# EAGLE design roller-shutter (EAGLE 9.6.2)
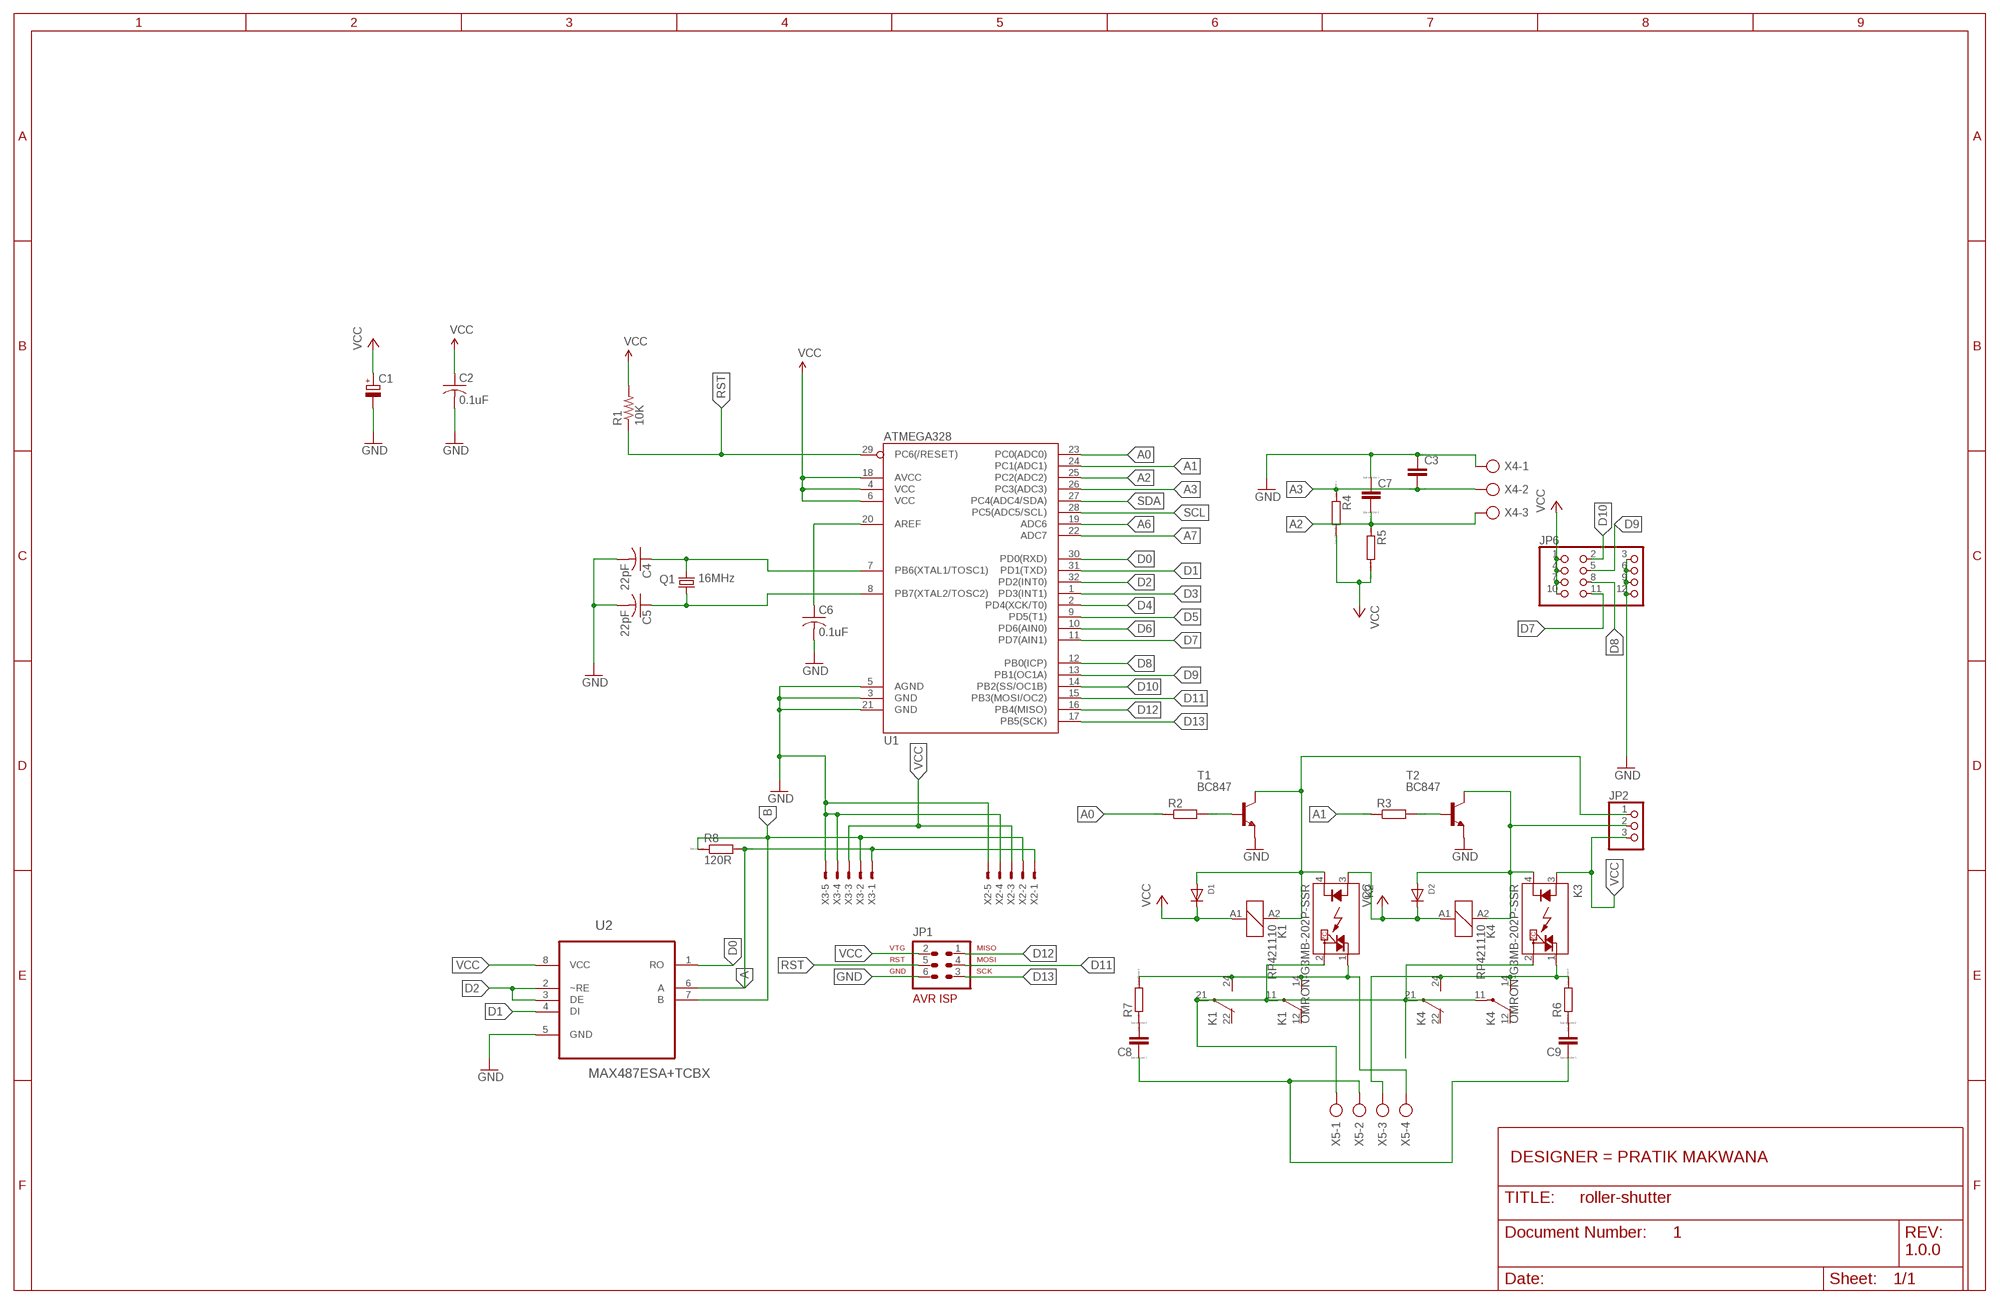
[diagram p0: schematic, sheet 1]
FRAME1 (FRAME_B_L): DESIGNER: PRATIK MAKWANA; DOC: 1; REV: 1.0.0

## Parts
C1  CPOL-EUSANYO_SMD_C6  [SANYO-OSCON_SMD_C6]
C2  0.1uF  C-USC0805  [C0805]
C3  C  [C0805]
C4  22pF  C-USC1206  [C1206]
C5  22pF  C-USC1206  [C1206]
C6  0.1uF  C-USC0805  [C0805]
C7  C  [C0805]
C8  CC1812  [C1812]
C9  CC1812  [C1812]
D1  DIODE_SOD-123FL  [SOD-123FL]
D2  DIODE_SOD-123FL  [SOD-123FL]
JP1  AVR-ISP-6  [AVR-ISP-6]
JP2  PINHD-1X3  [1X03]
JP6  PINHD-3X4  [3X04]
K1  RP421110  [RP420]
K2  OMRON-G3MB-202P-SSR  [OMRON-G3MB-202P-SSR]
K3  OMRON-G3MB-202P-SSR  [OMRON-G3MB-202P-SSR]
K4  RP421110  [RP420]
Q1  16MHz  CRYTALHC49S  [HC49/S]
R1  10K  R-US_R1206  [R1206]
R2  RR1206  [R1206]
R3  RR1206  [R1206]
R4  RR1206  [R1206]
R5  RR1206  [R1206]
R6  RR2512  [R2512]
R7  RR2512  [R2512]
R8  120R  RR0603  [R0603]
T1  BC847  [SOT23]
T2  BC847  [SOT23]
U1  ATMEGA328  [TQFP32-08]
U2  MAX487ESA+TCBX  [SOIC127P600X175-8N]
X2  JST-XH-05-PIN-LONG-PAD  [JST-XH-05-PACKAGE-LONG-PAD]
X3  JST-XH-05-PIN-LONG-PAD  [JST-XH-05-PACKAGE-LONG-PAD]
X4  AK500/3  [AK500/3]
X5  AK500/4  [AK500/4]

## Nets
A: R8.2 U2.6(A) X2.1 X3.1
A0: R2.1 U1.23(PC0(ADC0))
A1: R3.1 U1.24(PC1(ADC1))
A2: C7.2 R5.1 U1.25(PC2(ADC2)) X4.3
A3: C3.2 R4.1 U1.26(PC3(ADC3)) X4.2
A6: U1.19(ADC6)
A7: U1.22(ADC7)
AREF: C6.1 U1.20(AREF)
B: R8.1 U2.7(B) X2.2 X3.2
D0: U1.30(PD0(RXD)) U2.1(RO)
D1: U1.31(PD1(TXD)) U2.4(DI)
D2: U1.32(PD2(INT0)) U2.2(~RE) U2.3(DE)
D3: U1.1(PD3(INT1))
D4: U1.2(PD4(XCK/T0))
D5: U1.9(PD5(T1))
D6: U1.10(PD6(AIN0))
D7: JP6.11 U1.11(PD7(AIN1))
D8: JP6.8 U1.12(PB0(ICP))
D9: JP6.5 U1.13(PB1(OC1A))
D10: JP6.2 U1.14(PB2(SS/OC1B))
D11: JP1.4 U1.15(PB3(MOSI/OC2))
D12: JP1.1 U1.16(PB4(MISO))
D13: JP1.3 U1.17(PB5(SCK))
GND: C1.- C2.2 C3.1 C4.2 C5.2 C6.2 C7.1 JP1.6 JP6.3 JP6.6 JP6.9 JP6.12 T1.2(E) T2.2(E) U1.3(GND) U1.5(AGND) U1.21(GND) U2.5(GND) X2.4 X2.5 X3.4 X3.5 X4.1
N$1: D1.A JP2.1 K1.A2 K2.4(K) T1.3(C)
N$2: D2.A JP2.2 K3.4(K) K4.A2 T2.3(C)
N$4: K1.11(2:P) K1.21(3:P) K2.2(DS2) K3.2(DS2) K4.11(2:P) K4.21(3:P) X5.1
N$5: R2.2 T1.1(B)
N$6: R3.2 T2.1(B)
N$7: K1.14(2:S) K1.24(3:S) K2.1(DS1) R7.2 X5.4
N$8: K3.1(DS1) K4.14(2:S) K4.24(3:S) R6.2 X5.3
N$9: C8.2 R7.1
N$10: C9.2 R6.1
N$11: C8.1 C9.1 X5.2
N$43: C4.1 Q1.2 U1.7(PB6(XTAL1/TOSC1))
N$44: C5.1 Q1.1 U1.8(PB7(XTAL2/TOSC2))
RST: JP1.5 R1.1 U1.29(PC6(/RESET))
SCL: U1.28(PC5(ADC5/SCL))
SDA: U1.27(PC4(ADC4/SDA))
VCC: C1.+ C2.1 D1.C D2.C JP1.2 JP2.3 JP6.1 JP6.4 JP6.7 JP6.10 K1.A1 K2.3(A) K3.3(A) K4.A1 R1.2 R4.2 R5.2 U1.4(VCC) U1.6(VCC) U1.18(AVCC) U2.8(VCC) X2.3 X3.3
Unconnected: K1.12(2:O) K1.22(3:O) K4.12(2:O) K4.22(3:O)

## Library data of the parts
C1 = rcl:CPOL-EU: POLARIZED CAPACITOR, European symbol; SPICEPREFIX: C
C2 C4-C6 = adafruit:C-US: CAPACITOR, American symbol
C3 C7-C9 = eagle-ltspice:C: CAPACITOR, European symbol; SPICEMODEL: NONE; SPICEPREFIX: C
D1 D2 = adafruit:DIODE: Diode SMADIODE - SMA Surface Mount Package 20V 1A Schottky Diode Digikey: 641-1014-6-ND DO-1N4148 - Through Hole Small Current Diode SOD-123 20V 1 A (.5mV Vf) Schottky Diode - Digikey: MBRX120TPMSCT-ND SOD-323 10V 570mA (.38mV Vf, 3ns) Schottky Diode - Digikey: ZLLS410CT-ND SOD-523 30V 30mA Schottky Diode (RB751S-40TE61) - Digikey: RB751S-40TE61CT-ND SOT23-R/W - SOT23 Package (R = Solder Paste/Reflow Ovens, W = Hand-Soldering) BAT54Film 40V 300mA - Digikey: 497-7162-1-ND
JP1 = atmel-1:AVR-ISP-6: AVR ISP-6 Serial Programming Header
JP2 = pinhead:PINHD-1X3: PIN HEADER
JP6 = pinhead-zmiany-JP:PINHD-3X4: PIN HEADER
K1 K4 = relay:RP42?*: Power PCB Relay RP II/2 Schrack 2 pole 8 A Source: http://www.schrack.com/.. 5844.pdf; MF: TYCO ELECTRONICS; MPN: RP421110; OC_FARNELL: unknown; OC_NEWARK: 39C2625
K2 K3 = Omron G3MB 202p SSR:OMRON-G3MB-202P-SSR: IT(rms) 8A, Zero Cross type SIP 4pin Triac output SSR Source: http://sharp-world.com/products/device/lineup/data/pdf/datasheet/s102s02_e.pdf
Q1 = crystal:CRYTAL: CRYSTAL
R1 = adafruit:R-US_: RESISTOR, American symbol
R2-R8 = eagle-ltspice:R: RESISTOR, European symbol; SPICEMODEL: NONE; SPICEPREFIX: R
T1 T2 = transistor:BC847: NPN TRANSISTOR
U1 = thecustomgeek:ATMEGA328: ATmega328P-AU TQFP 32 pin
U2 = MAX487ESA_TCBX:MAX487ESA+TCBX: Low-Power, Slew-Rate-Limited RS-485/RS-422 Transceivers Check prices <https://pricing.snapeda.com/parts/MAX487ESA%2BTCBX/Maxim%20Integrated/view-part?ref=eda>; AVAILABILITY: Warning; DESCRIPTION: 1/1 Transceiver Half RS422, RS485 8-SOIC; MF: Maxim Integrated; MP: MAX487ESA+TCBX; PACKAGE: SOIC-8 Maxim Integrated; PRICE: None; PURCHASE-URL: https://pricing.snapeda.com/search/part/MAX487ESA+TCBX/?ref=eda
X2 X3 = Rembrandt Electronics - JST XH Connectors v1-0:JST-XH-05-PIN: JST XH Connector 2 Pin Wire to board connector. Pitch: 2,54 mm, (0.100") Number of pins: 5 Created by Rembrandt Electronics www.rembrandtelectronics.com
X4 = con-ptr500:AK500/3: CONNECTOR; OC_FARNELL: unknown; OC_NEWARK: unknown
X5 = con-ptr500:AK500/4: CONNECTOR; OC_FARNELL: unknown; OC_NEWARK: unknown

## Board
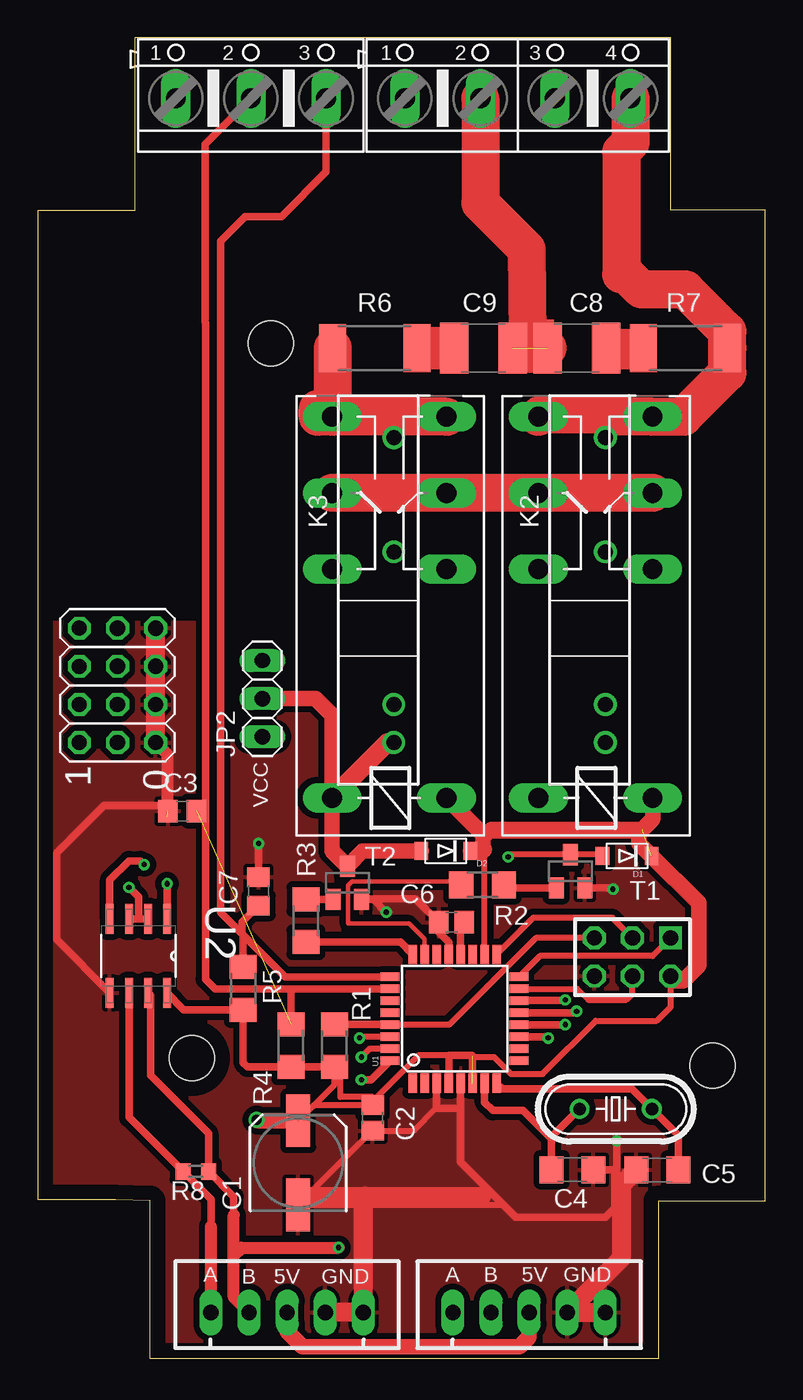
[diagram p1: board, top side]
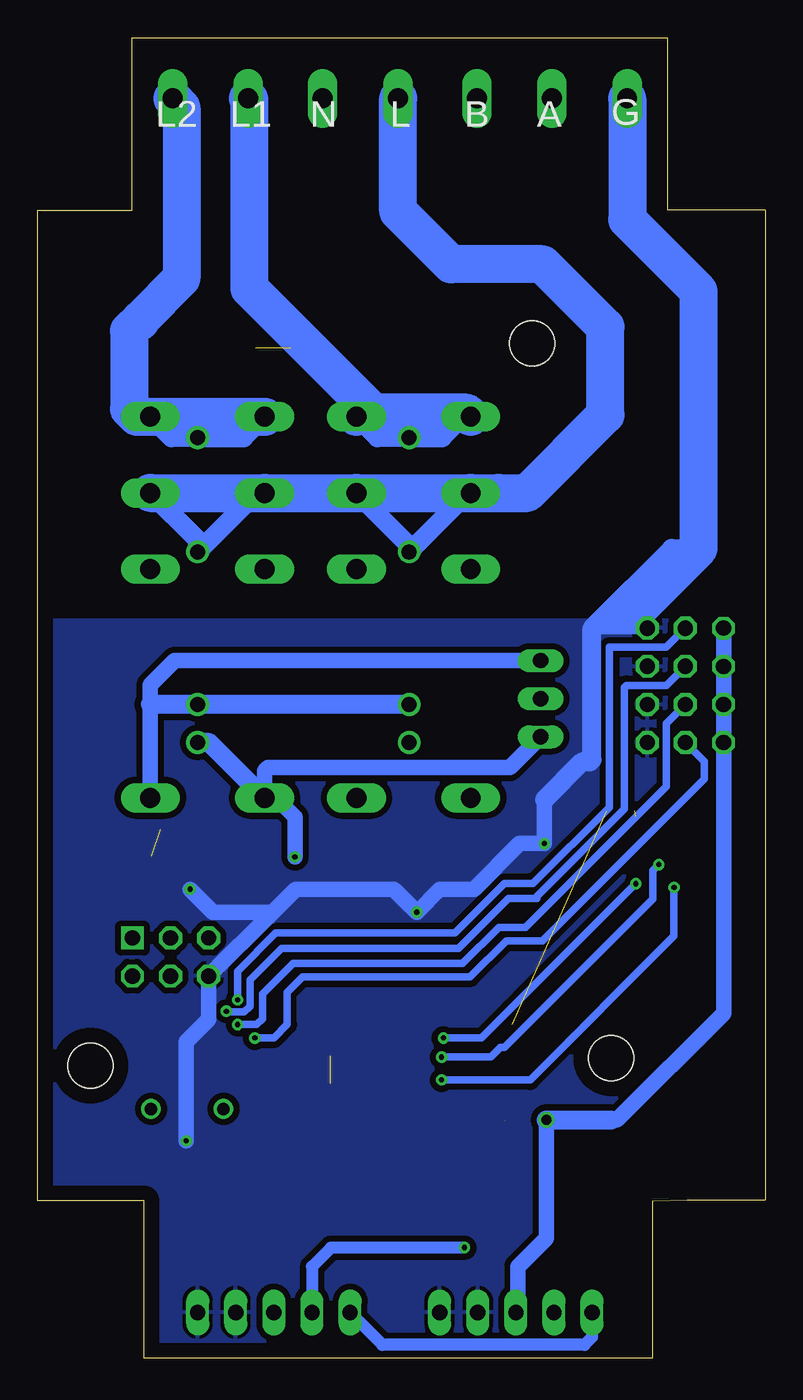
[diagram p2: board, bottom side, seen from below]

Size 48.5 x 88 mm. Coordinates in mm from the lower left corner, seen from the top.
Outline: 7.5,0 41.4,0 41.4,10.5 48.5,10.5 48.5,76.5 42.2,76.5 42.2,88 6.5,88 6.5,76.5 0,76.5 0,10.54 5.21,10.54 7.5,10.5 7.5,0
Copper layers (1*16): Top 0.035mm / dielectric 1.5mm / Bottom 0.035mm
Design rules "default": minimum track width 6mil, minimum drill 0.35mm, track to track 6mil, track to pad 6mil, pad to pad 6mil, via to via 6mil, smd to smd 6mil, copper to edge 40mil, drill to drill 6mil, minimum pad ring 10mil, minimum via ring 8mil, stop-mask expansion 4mil, vias tented up to drill 0mil, thermal gap 10mil
Holes 3 mm at 10.3,20 15.55,67.62 45,19.5

### Footprints (pad centres in the part's own frame; a part is rotated, then mirrored left to right if it is on the bottom)
SANYO-OSCON_SMD_C6 = smd 3.5 x 1.6: + 2.8,0; - -2.8,0
C0805 = smd 1.3 x 1.5: 1 -0.85,0; 2 0.85,0
C0805' = smd 1.3 x 1.5: 1 -0.95,0; 2 0.95,0
C1206 = smd 1.6 x 1.8: 1 -1.4,0; 2 1.4,0
C1812 = smd 1.9 x 3.4: 1 -1.95,0; 2 1.95,0
SOD-123FL = smd 0.91 x 1.22: A 1.637,0; C -1.637,0
AVR-ISP-6 = drill 1.016 square: 1 -2.54,-1.27 | drill 1.016 octagon: 2 -2.54,1.27; 3 0,-1.27; 4 0,1.27; 5 2.54,-1.27; 6 2.54,1.27
1X03 = drill 1.016 long: 1 -2.54,0; 2 0,0; 3 2.54,0
3X04 = drill 1 octagon: 1 -3.81,-3.81; 4 -1.27,-3.81; 7 1.27,-3.81; 10 3.81,-3.81 | drill 1.016 octagon: 2 -3.81,-1.27; 3 -3.81,1.27; 5 -1.27,-1.27; 6 -1.27,1.27; 8 1.27,-1.27; 9 1.27,1.27; 11 3.81,-1.27; 12 3.81,1.27
RP420 = drill 1.321 long: 11 16.51,-3.81; 12 11.43,-3.81; 14 21.59,-3.81; 21 16.51,3.81; 22 11.43,3.81; 24 21.59,3.81; A1 -3.81,-3.81; A2 -3.81,3.81
OMRON-G3MB-202P-SSR = drill 1: 1 -12.7,0; 2 -5.08,0; 3 5.08,0; 4 7.62,0
HC49/S = drill 0.813: 1 -2.413,0; 2 2.413,0
R1206 = smd 1.6 x 1.803: 1 -1.422,0; 2 1.422,0
R2512 = smd 1.8 x 3.2: 1 -2.8,0; 2 2.8,0
R0603 = smd 1 x 1.1: 1 -0.85,0; 2 0.85,0
SOT23 = smd 1 x 1.4: 1 -0.95,-1.1; 2 0.95,-1.1; 3 0,1.1
TQFP32-08 = smd 1.27 x 0.559: 1 -4.293,2.8; 2 -4.293,2; 3 -4.293,1.2; 4 -4.293,0.4; 5 -4.293,-0.4; 6 -4.293,-1.2; 7 -4.293,-2; 8 -4.293,-2.8; 17 4.293,-2.8; 18 4.293,-2; 19 4.293,-1.2; 20 4.293,-0.4; 21 4.293,0.4; 22 4.293,1.2; 23 4.293,2; 24 4.293,2.8 | smd 0.559 x 1.27: 9 -2.8,-4.293; 10 -2,-4.293; 11 -1.2,-4.293; 12 -0.4,-4.293; 13 0.4,-4.293; 14 1.2,-4.293; 15 2,-4.293; 16 2.8,-4.293; 25 2.8,4.293; 26 2,4.293; 27 1.2,4.293; 28 0.4,4.293; 29 -0.4,4.293; 30 -1.2,4.293; 31 -2,4.293; 32 -2.8,4.293
SOIC127P600X175-8N = smd 1.981 x 0.533: 1 -2.464,1.905; 2 -2.464,0.635; 3 -2.464,-0.635; 4 -2.464,-1.905; 5 2.464,-1.905; 6 2.464,-0.635; 7 2.464,0.635; 8 2.464,1.905
JST-XH-05-PACKAGE-LONG-PAD = drill 1.016 long: 1 -5.08,0; 2 -2.54,0; 3 0,0; 4 2.54,0; 5 5.08,0
AK500/3 = drill 1.321 long: 1 -5.004,0; 2 0,0; 3 5.004,0
AK500/4 = drill 1.321 long: 1 -7.518,0; 2 -2.489,0; 3 2.489,0; 4 7.518,0

### Placement (x,y rotation side)
C1  17.38,13.02 90 top
C2  22.34,16.01 270 top
C3  [C0805']  9.65,36.45 0 top
C4  35.66,12.56 0 top
C5  41.33,12.54 180 top
C6  27.6,29.05 180 top
C7  [C0805']  14.73,31.11 270 top
C8  35.94,67.31 0 top
C9  29.72,67.31 180 top
D1  39.28,33.46 180 top
D2  27.22,33.79 180 top
JP1  39.66,26.73 180 top
JP2  14.99,43.94 90 top
JP6  6.6,44.83 270 top
K1  37.19,41.15 90 top
K2  37.85,48.64 270 top
K3  23.75,48.64 270 top
K4  23.45,41.15 90 top
Q1  38.54,16.6 180 top
R1  19.79,20.82 270 top
R2  29.66,31.55 0 top
R3  17.9,29.15 90 top
R4  16.89,20.83 270 top
R5  13.72,24.64 270 top
R6  22.48,67.31 180 top
R7  43.18,67.31 0 top
R8  10.54,12.45 180 top
T1  35.52,32.45 0 top
T2  20.66,31.68 0 top
U1  27.8,22.62 90 top
U2  6.73,26.8 270 top
X2  16.64,3.05 0 top
X3  32.77,3.05 0 top
X4  14.22,83.95 0 top
X5  32,83.95 0 top

### Tracks (layer width: path | path; a pad name or v marks a point on that pad's centre or on a via)
A
  Top 0.508: 11.56,8.76 11.56,10.58 R8.2 6.1,16.04 U2.6
  Top 0.813: X2.1 11.56,8.76
  Bottom 0.813: X2.1 11.56,1.4 12.06,0.89 25.53,0.89 X3.1
A0
  Top 0.305: U1.23 25.8,27.92 24.77,28.96 20.7,28.96 20.7,31.5 20.95,31.75 28.04,31.75 R2.1
A1
  Top 0.508: U1.24 24.18,27.73 R3.1
A2
  Top 0.508: U1.25 16.49,25.42 13.72,28.19 | 13.72,28.19 13.65,28.26 | 13.65,28.26 12.19,29.72 12.19,74.42 13.84,76.07 16.26,76.07 19.23,79.05 X4.3 | R5.1 13.72,28.19 | 13.65,28.26 13.65,29.09 C7.2
A3  (1 unrouted)
  Top 0.508: 17.02,24.62 11.83,24.62 11.2,25.25 11.2,69 11.18,69.02 11.18,80.9 X4.2 | 17.02,24.62 U1.26 | R4.1 16.89,24.49 17.02,24.62
AREF
  Top 0.508: U1.20 28.2,28.8 C6.1
B  (via drill 0.35)
  Top 0.508: 13.08,9.53 13.08,10.76 R8.1 11.39,14.99 7.53,18.85 7.53,24.17 U2.7
  Top 0.813: X2.2 13.08,4.06 13.08,6.86 | 13.08,6.86 13.08,9.53 | 13.08,6.86 13.59,7.37 v20.07,7.37
  Bottom 0.813: v20.07,7.37 28.96,7.37 30.23,6.1 X3.2
D0  (via drill 0.35)
  Top 0.406: U1.30 21.55,21.42 v21.46,21.34
  Top 0.508: U2.1 v8.64,31.62
  Bottom 0.508: v8.64,31.62 18.92,21.34 v21.46,21.34
D1  (via drill 0.35)
  Top 0.406: U1.31 22.14,20.62 v21.59,20.07
  Top 0.508: U2.4 4.83,31.88 6.1,33.15 6.86,33.15 v7.11,32.89
  Bottom 0.508: v7.11,32.89 7.49,32.51 7.49,30.61 17.4,20.7 17.65,20.7 18.29,20.07 v21.59,20.07
D2  (via drill 0.35)
  Top 0.508: U2.2 6.73,29.26 | 6.73,29.26 U2.3 | U1.32 22.23,18.54 v21.59,18.54 | 6.73,29.26 6.73,30.73 v6.1,31.37
  Bottom 0.508: v6.1,31.37 6.1,28.12 15.68,18.54 v21.59,18.54
D7  (via drill 0.35)
  Top 0.508: U1.11 33.95,21.42 v34.04,21.34
  Bottom 0.508: v34.04,21.34 32.77,21.34 31.88,22.23 31.88,24.38 30.86,25.4 19.68,25.4 17.27,27.81 14.86,27.81 4.06,38.61 4.06,39.75 JP6.11
D8  (via drill 0.35)
  Top 0.508: U1.12 v35.17,22.22 v35.18,22.23
  Bottom 0.508: v35.18,22.23 33.91,22.23 33.53,22.61 33.53,24.26 31.5,26.29 20.19,26.29 17.78,28.7 16,28.7 6.6,38.1 6.6,42.29 JP6.8
D9  (via drill 0.35)
  Top 0.508: U1.13 35.85,23.02 v35.94,23.11
  Bottom 0.508: v35.94,23.11 35.89,23.06 34.75,23.06 34.37,23.44 34.37,25.2 32.26,27.3 20.45,27.3 17.12,30.63 15.24,30.63 15.24,30.76 9.4,36.6 9.4,44.7 9.27,44.83 6.6,44.83 JP6.5
D10  (via drill 0.35)
  Top 0.508: U1.14 35.13,23.82 v35.18,23.88
  Bottom 0.508: v35.18,23.88 35.18,25.78 32.64,28.32 20.7,28.32 17.4,31.62 15.49,31.62 10.41,36.7 10.41,47.37 6.6,47.37 JP6.2
D11
  Top 0.406: U1.15 35.96,24.62 36.7,23.88 39.24,23.88 39.66,24.29 JP1.4
D12
  Top 0.406: JP1.1 40.99,26.8 33.47,26.8 U1.16
D13
  Top 0.406: JP1.3 38.32,29.34 33.02,29.34 U1.17
GND  (via drill 0.35)  (1 unrouted)
  Top 0.254: C6.2 26.31,29.49 | C6.2 26.12,29.68 | C6.2 26.75,28.38 | 26.6,16.71 | 26.6,16.71 26.6,17.65 | U1.3
  Top 0.406: C2.2 C1.- 31.05,10.22 | C2.2 25.05,15.16 26.6,16.71
  Top 0.508: v38.35,31.24 38.25,31.35 T1.2 | U1.21 27.41,26.93 27.41,27.72 26.75,28.38 C6.2 26.31,29.49 26.12,29.68 25.19,30.61 21.64,30.61 T2.2 22.38,30.58 v23.24,29.72 | C4.2 38.48,12.56 38.48,11.29 | 38.48,11.29 38.61,11.29 | 38.61,11.29 38.68,11.29 C5.2 | U1.5 28.2,16.64 | 28.2,16.64 28.2,13.07 31.05,10.22 31.88,9.4 37.85,9.4 38.48,10.03 38.48,11.29 | 38.61,11.29 v38.61,14.48 | U1.3 26.6,17.65 26.6,16.71 26.67,16.64 28.2,16.64 | C7.1 v14.73,34.29 | U2.5 1.27,27.89 1.27,33.66 4.45,36.83 8.32,36.83 C3.1
  Top 0.813: JP6.12 8.64,40.26 8.64,36.08
  Top 1.27: C1.- 17.95,10.79 21.84,10.79 | 21.84,10.79 29.59,10.79 | X2.4 X2.5 21.72,10.67 21.84,10.79 | X3.5 X3.4 38.91,6.65 38.91,11.52 C5.2 | JP6.12 JP6.9 JP6.6 JP6.3
  Bottom 0.254: JP1.6 37.12,24.51
  Bottom 1.016: 32.86,29.72 JP1.6 37.12,24.51 37.12,22.57 38.61,21.08 v38.61,14.48 | 32.86,29.72 31.33,31.24 24.77,31.24 v23.24,29.72 21.72,31.24 19.43,31.24 16.38,34.29 v14.73,34.29 14.73,37.21 | 32.86,29.72 36.83,29.72 v38.35,31.24 | 7.87,48.87 JP6.3 7.87,48.51
  Bottom 1.27: 14.73,37.21 12.19,39.75 11.68,39.75 11.56,39.88 11.56,48.64 11.33,48.87 | 11.33,48.87 7.87,48.87 | 11.33,48.87 6.25,53.95 4.45,53.95
  Bottom 2.54: X4.1 9.22,75.87 4.45,71.09 4.45,53.95 8.48,49.91 8.76,49.91
  pour Top (isolate 0.406): 0.13,49.02 48.51,49.02 48.51,10.54 41.53,10.54 41.53,0.13 41.4,0 7.37,0 7.24,0.13 7.24,10.03 7.49,10.29 0.38,10.29 0.13,10.54
  pour Bottom (isolate 0.406): 0.13,49.15 48.51,49.15 48.51,10.41 41.78,10.41 41.66,10.54 41.66,0 41.53,-0.13 7.62,-0.13 7.37,0.13 7.37,10.54 -0.13,10.54 -0.13,49.15
N$1  (via drill 0.35)
  Top 0.406: v31.37,33.4 31.52,33.55 T1.3 37.56,33.55 D1.A
  Bottom 1.016: v31.37,33.4 31.37,36.07 32.64,37.34 K1.A2 33.38,39.14 33.15,39.37 17.02,39.37 JP2.1
  Bottom 1.27: K1.A2 37.07,41.02 K2.4
N$2
  Top 1.016: D2.A 21.68,33.79 T2.3 19.64,33.8 K4.A2 19.64,42.84 18.54,43.94 JP2.2
  Top 1.27: K4.A2 23.33,41.02 K3.4
N$4
  Top 2.54: K1.11 K4.21
  Bottom 1.27: K3.2 19.82,57.66 K4.21 | 23.75,54.14 K4.11 | K1.21 33.91,57.66 K2.2 37.85,54.5 K1.11
  Bottom 2.54: K1.11 K1.21 K4.11 K4.21 | K4.21 17.78,57.66 | K4.21 15.88,57.66 10.67,62.87 10.67,68.71 14.86,72.9 20.95,72.9 24.49,76.43 X5.1
N$5
  Top 0.508: T1.1 31.28,31.35 R2.2
N$6
  Top 0.508: T2.1 R3.2
N$7
  Top 2.54: K1.24 33.51,62.87 38.35,62.87 38.48,62.73 K1.14 43.05,62.73 45.98,65.67 R7.2 45.98,68.41 43.18,71.21 40.25,71.21 39.26,72.21 38.91,72.21 38.91,80.39 39.52,81 X5.4
  Bottom 1.27: K1.24 34.77,61.34 K2.1 39.61,61.34 K1.14
  Bottom 2.54: 41.66,69.09 41.66,69.22 | 41.66,69.22 42.42,68.45 42.42,63.25 41.91,62.73 K1.14 K1.24 | 41.66,69.22 38.91,71.96 38.91,83.34 X5.4
N$8
  Top 2.54: K4.14 K4.24 18.67,62.73 18.67,63.25 19.68,63.25 R6.2
  Bottom 1.27: 19.9,62.99 21.55,61.34 K3.1 25.87,61.34 K4.14
  Bottom 2.54: 27.26,64.13 34.42,71.29 34.42,83.87 X5.3 | K4.14 27.26,64.13 | K4.24 19.9,62.99 26.12,62.99 27.26,64.13
N$9
  Top 1.016: R7.1 40.25,67.18 38.02,67.18 C8.2
N$10
  Top 1.016: C9.2 27.64,67.18 25.41,67.18 R6.1
N$11  (1 unrouted)
  Top 2.54: X5.2 29.52,76.96 32.59,73.88 32.64,68.03 C8.1
N$43
  Top 0.508: C4.1 34.26,14.61 34.2,14.67 | 34.2,14.67 Q1.2 | 34.2,14.67 32.36,16.51 30.35,16.51 29.8,17.06 U1.7
N$44
  Top 0.508: C5.1 42.73,14.83 Q1.1 | Q1.1 40.78,16.42 | U1.8 30.98,17.95 39.61,17.95 Q1.1
RST
  Top 0.406: 37.06,27.94 JP1.5 33.2,28 27.43,22.22 U1.29
  Top 0.508: U1.29 23.48,22.25 R1.1
VCC  (via drill 0.65)  (3 unrouted)
  Top 0.254: C1.+ 18.24,16.68
  Top 0.406: U1.18 29.8,33.4 | 29.8,33.4 29.8,33.91 29.8,34.8 39.88,34.8 | 40.07,34.99 39.88,34.8 | 39.88,34.8 40.92,33.75 D1.C | D2.C 29.25,33.4 29.8,33.4 | 27.43,20.19 25.4,20.19 22.48,17.27 22.35,17.4 | 22.35,17.4 20.19,17.4 20.19,19 R1.2 19.79,18.23 18.42,16.86 | 22.35,17.36 22.35,17.4 | C1.+ 18.24,16.68 18.42,16.86 | C2.1 18.42,16.86 | 29,20.15 29.08,20.07 30.43,20.07 31.56,18.94 33.67,18.94 37.21,22.48 41.27,22.48 42.2,23.4 JP1.2
  Top 0.508: U1.6 29,20.15 28.96,20.19 27.43,20.19 27.43,18.36 U1.4 | R1.2 R4.2 13.99,19.41 13.72,19.68 R5.2 9.75,23.22 U2.8
  Top 1.016: X2.3 16.64,1.78 17.65,0.76 32.13,0.76 32.77,1.4 X3.3 32.77,2.54 | C1.+ 14.66,15.82 v14.61,15.88 | K1.A1 41,35.92 40.32,35.24 | JP1.2 42.51,25.15 43.05,25.15 44.07,26.16 44.07,30.35 44.03,30.35 D1.C 40.07,34.31 40.07,34.99 40.32,35.24 30.25,35.24 29.8,34.8 | D2.C 29.69,33.79 | 29.8,33.91 29.69,33.79 | 29.69,33.79 29.69,34.68 29.8,34.8 | 29.8,34.8 K4.A1
  Bottom 1.016: X2.3 16.51,3.17 16.51,6.1 14.61,8 v14.61,15.88 | JP2.3 39.37,46.48 41,44.85 41,43.56 K1.A1 | 10.29,15.88 9.91,15.88 2.79,22.99 JP6.10 JP6.7 JP6.4 JP6.1
  Bottom 1.27: v14.61,15.88 10.29,15.88 | K3.3 K2.3 41,43.56
(copper drawn outside any net)
  shapes: Top area x4

### Text on the board
tPlace: VCC
tNames: 1 | 0 | A | B | 5V | GND | A | B | 5V | GND
bNames: G | A | B | L | N | L1 | L2
bValues: Falcon IoT / Roller Shutter v1.0 / weblogic.pl / falcon.software